# Altium schematic sheet Sek_CTRL.SchDoc: Sheetname
size A4; Date: 05.10.2017; CheckedBy: UNCHECKED; Author: Team Member; Organization: Baltic Racing; Address1: Zur Schwedenschanze 15; Address2: Haus 18; Address3: 18435 Stralsund; Revision: xx.xx; SheetNumber: 4; SheetTotal: 8; Rules: TODO; ProjectName: Projekt
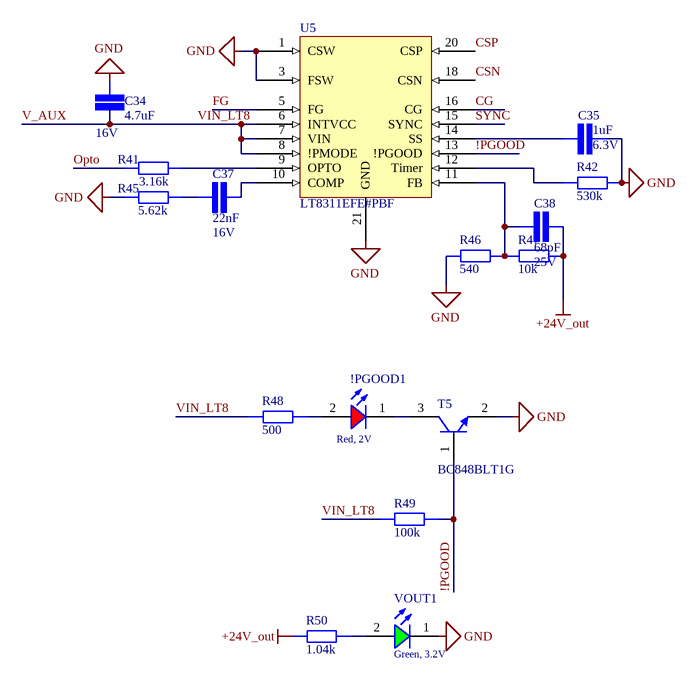
[diagram p0: Sek_CTRL.SchDoc]

## Parts
!PGOOD1  Red, 2V  [WL-SMCW_0603_H=0.7mm]
C34  value 4.7uF  Voltage: 16V  [CAP 0603/1608]  (hidden comment: SMD Capacitor)
C35  value 1uF  Voltage: 6.3V  [CAP 0603/1608]  (hidden comment: SMD Capacitor)
C37  value 22nF  Voltage: 16V  [CAP 0603/1608]  (hidden comment: SMD Capacitor)
C38  value 68pF  Voltage: 25V  [CAP 0603/1608]  (hidden comment: SMD Capacitor)
R41  value 3.16k  [STACKPOLE CSR0603]  (hidden comment: SMD Resistor)
R42  value 530k  [STACKPOLE CSR0603]  (hidden comment: SMD Resistor)
R45  value 5.62k  [STACKPOLE CSR0603]  (hidden comment: SMD Resistor)
R46  value 540  [STACKPOLE CSR0603]  (hidden comment: SMD Resistor)
R47  value 10k  [STACKPOLE CSR0603]  (hidden comment: SMD Resistor)
R48  value 500  [STACKPOLE CSR0603]  (hidden comment: SMD Resistor)
R49  value 100k  [STACKPOLE CSR0603]  (hidden comment: SMD Resistor)
R50  value 1.04k  [STACKPOLE CSR0603]  (hidden comment: SMD Resistor)
T5  BC848BLT1G  [ONSC-SOT-23-3-318-08_V]
U5  LT8311EFE#PBF  [TSSOP 20 Lead LT8311]
VOUT1  Green, 3.2V  [WL-SMCW_0603_H=0.7mm]

## Nets
+24V_out: C38.2 R47.1 R50.1
GND: C34.2 C35.2 R42.2 R45.2 R46.2 T5.2(E) U5.1(CSW) U5.3(FSW) U5.21(GND) VOUT1.1(K)
!PGOOD: R49.1 T5.1(B) U5.13(!PGOOD)
CG: U5.16(CG)
CSN: U5.18(CSN)
CSP: U5.20(CSP)
FG: U5.5(FG)
Opto: R41.1
SYNC: U5.15(SYNC)
V_AUX: C34.1 R48.2 R49.2 U5.6(INTVCC) U5.7(VIN) U5.8(!PMODE)  [also labelled VIN_LT8]
Net!PGOOD1_1: !PGOOD1.1(K) T5.3(C)
Net!PGOOD1_2: !PGOOD1.2(A) R48.1
NetC35_1: C35.1 U5.14(SS)
NetC37_1: C37.1 R45.1
NetC37_2: C37.2 U5.10(COMP)
NetC38_1: C38.1 R46.1 R47.2 U5.11(FB)
NetR41_2: R41.2 U5.9(OPTO)
NetR42_1: R42.1 U5.12(Timer)
NetR50_2: R50.2 VOUT1.2(A)

## Notes on the sheet
- Title:
- Projekt:
- Revision:
- Author:
- Rules:
- Checked by:
- Sheet
- of
- Size:
- A4
- Date:
- Time:

## Library data of the parts
!PGOOD1 = 150060RS75000: WL-SMCW SMT Mono-color Chip LED Waterclear, size 0603, Red, 2V, 140deg; Chip Technology: AlInGaP; Dominant Wavelength typ.: 625nm; Luminous Intensity typ.: 250mcd; Peak Wavelength typ.: 630nm; Viewing Angle: 140deg; ComponentLink1Description: Manufacturer; ComponentLink1URL: http://www.we-online.de; ComponentLink2URL: https://www.we-online.com/catalog/datasheet/150060RS75000.pdf; ComponentLink2Description: Datasheet; Forward Voltage typ.: 2V; Emitting Color: Red; Mounting Technology: SMT; Operating Temperature: -40 to +85degC; Published Date: December 2019; Part Number: 150060RS75000; Packaging: Tape and Reel; Size: 0603; Publisher: Wurth Elektronik
C34 C35 C37 C38 = SMD Capacitor: Capacitor with multiple Footprints
R41 R42 R45-R50 = SMD Resistor: Resistor with multiple footprints
T5 = CMP-1048-00679-1: General Purpose Transistor, NPN Silicon, 3-Pin SOT-23, Pb-Free, Tape and Reel; Manufacturer: On Semiconductor; fT Min (MHz): 100; IC Continuous (A): 0.1; DatasheetVersion: Rev. 11; PackageVersion: Rev. AP, 11/2009; RoHS: TRUE; PartNumber: BC848BLT1G; ComponentLink1Description: Manufacturer URL; PackageReference: SOT-23-3-318-08; ComponentLink3Description: Package Specification; ComponentLink1URL: http://www.onsemi.com/; Polarity: NPN; ComponentLink2Description: Datasheet; ComponentLink2URL: http://www.onsemi.cn/pub_link/Collateral/BC846ALT1-D.PDF; ComponentLink3URL: http://www.onsemi.cn/pub_link/Collateral/318-08.PDF; PackageDescription: 3-Pin Small Outline Transistor, Body 2.92 x 1.3 mm, Pitch 0.95 mm; Packing: Tape and Reel; Mounting Technology: Surface Mount
U5 = LT8311EFE#PBF: LT8311 - Synchronous Rectifier Controller with Opto-Coupler Driver for Forward Converters; Manufacturer: Analog Devices / Linear Technology; Operating Supply Current: 4.5mA; Min Supply Voltage: 3.7V; Max Supply Voltage: 30V; Supplier 1: Digi-Key; Manufacturer Part Number: LT8311EFE#PBF; RoHS: Yes; Category: Gate Drivers; Pricing 1: 1=7,34000, 10=6,63200, 25=6,32360, 100=5,49060, 250=5,24384, 500=4,80150 (USD); Mount: Surface Mount; Case/Package: TSSOP; Number of Pins: 20; Min Operating Temperature: -40°C; Max Operating Temperature: 150°C; Packaging: Rail/Tube; Package Quantity: 74; RoHS Compliant: Yes; REACH SVHC: No SVHC; ComponentLink1URL: https://datasheet.ciiva.com/46423/1810721-46423691.pdf?src-supplier=Element14; ComponentLink1Description: https://datasheet.ciiva.com/46423/1810721-46423691.pdf?src-supplier=Element14; ComponentLink2URL: https://datasheet.ciiva.com/29699/44625-29699311.pdf?src-supplier=Digi-Key; ComponentLink2Description: https://datasheet.ciiva.com/29699/44625-29699311.pdf?src-supplier=Digi-Key
VOUT1 = 150060GS75000: WL-SMCW SMT Mono-color Chip LED Waterclear, size 0603, Green, 3.2V, 140deg; Chip Technology: InGaN; Dominant Wavelength typ.: 525nm; Luminous Intensity typ.: 430mcd; Peak Wavelength typ.: 515nm; Viewing Angle: 140deg; ComponentLink1Description: Manufacturer; ComponentLink1URL: http://www.we-online.de; ComponentLink2URL: https://www.we-online.com/catalog/datasheet/150060GS75000.pdf; ComponentLink2Description: Datasheet; Forward Voltage typ.: 3.2V; Emitting Color: Green; Mounting Technology: SMT; Operating Temperature: -40 to +85degC; Published Date: December 2019; Part Number: 150060GS75000; Packaging: Tape and Reel; Size: 0603; Publisher: Wurth Elektronik